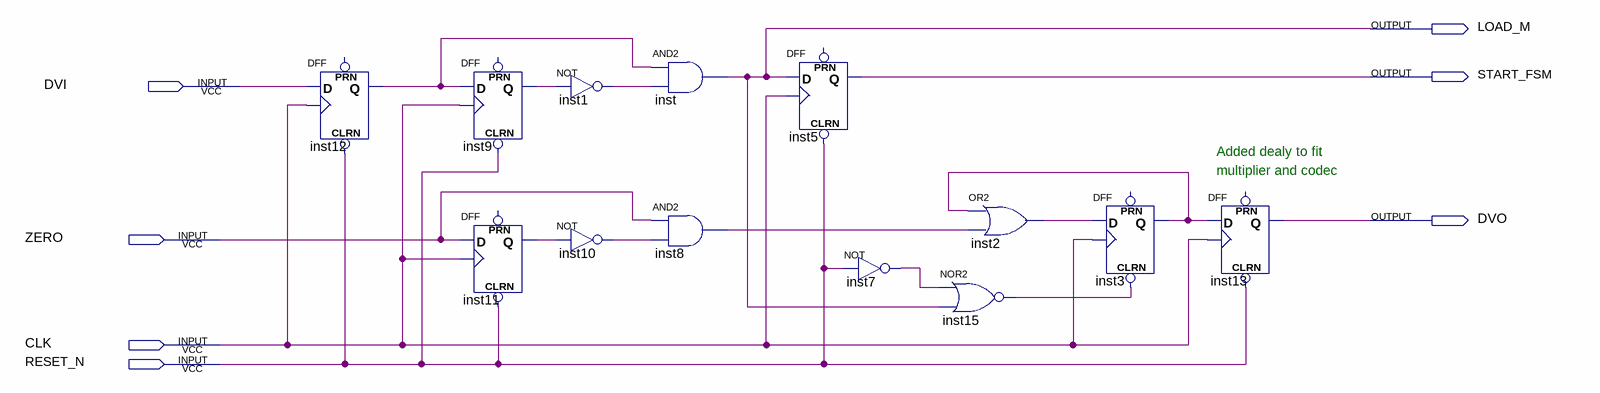
[diagram p0: schematic sheet]
// Quartus schematic wb_mul_dvCtrl.bdf as structural Verilog: 13 symbols, 7 pins
module wb_mul_dvCtrl (
  input  DVI,
  input  ZERO,
  input  CLK,
  input  RESET_N,
  output LOAD_M,
  output START_FSM,
  output DVO
);

  wire inst1_out, inst2_out, inst3_q, inst7_out, inst8_out, inst9_q, inst10_out, inst11_q, inst12_q,
       inst15_out;

  DFF inst12 (.CLRN(RESET_N), .CLK(CLK), .D(DVI), .Q(inst12_q));  // open: PRN
  DFF inst9 (.CLRN(RESET_N), .CLK(CLK), .D(inst12_q), .Q(inst9_q));  // open: PRN
  DFF inst11 (.CLRN(RESET_N), .CLK(CLK), .D(ZERO), .Q(inst11_q));  // open: PRN
  not inst1 (inst1_out, inst9_q);
  not inst10 (inst10_out, inst11_q);
  and inst (LOAD_M, inst12_q, inst1_out);
  and inst8 (inst8_out, ZERO, inst10_out);
  DFF inst5 (.CLRN(RESET_N), .CLK(CLK), .D(LOAD_M), .Q(START_FSM));  // open: PRN
  not inst7 (inst7_out, RESET_N);
  nor inst15 (inst15_out, inst7_out, LOAD_M);
  or inst2 (inst2_out, inst3_q, inst8_out);
  DFF inst3 (.CLRN(inst15_out), .CLK(CLK), .D(inst2_out), .Q(inst3_q));  // open: PRN
  DFF inst13 (.CLRN(RESET_N), .CLK(CLK), .D(inst3_q), .Q(DVO));  // open: PRN

  // Notes on the sheet:
  //   Added dealy to fit
  //   multiplier and codec
endmodule
